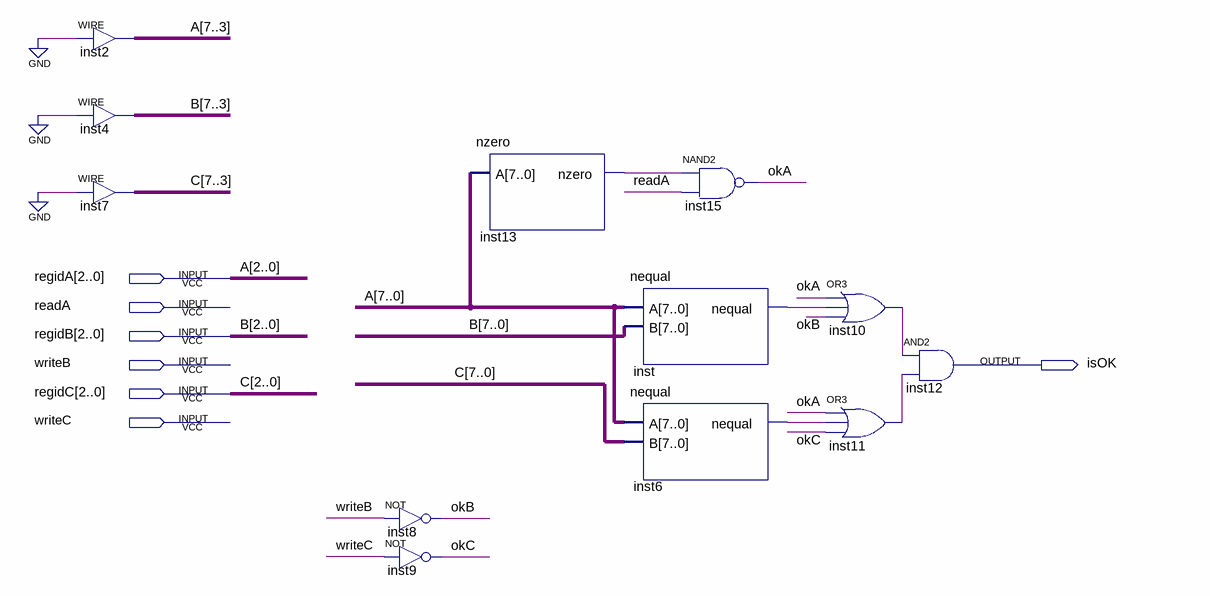
[diagram p0: schematic sheet]
// Quartus schematic ConflictChecker.bdf as structural Verilog: 12 symbols, 7 pins
module ConflictChecker (
  input  [2:0] regidA,
  input  readA,
  input  [2:0] regidB,
  input  writeB,
  input  [2:0] regidC,
  input  writeC,
  output isOK
);

  wire inst6_nequal, inst10_out, inst11_out, inst13_nzero, inst_nequal, okA, okB, okC;
  wire [7:3] A, B, C;

  assign A = {5{1'b0}};  // WIRE inst2
  assign B = {5{1'b0}};  // WIRE inst4
  assign C = {5{1'b0}};  // WIRE inst7
  not inst8 (okB, writeB);
  not inst9 (okC, writeC);
  nzero inst13 (.A({A, regidA}), .nzero(inst13_nzero));
  nequal inst (.A({A, regidA}), .B({B, regidB}), .nequal(inst_nequal));
  nequal inst6 (.A({A, regidA}), .B({C, regidC}), .nequal(inst6_nequal));
  nand inst15 (okA, inst13_nzero, readA);
  or inst10 (inst10_out, okA, inst_nequal, okB);
  or inst11 (inst11_out, okA, inst6_nequal, okC);
  and inst12 (isOK, inst10_out, inst11_out);

  // Other names for the same wires on the sheet: A[2:0] = regidA; B[2:0] = regidB; C[2:0] = regidC
endmodule
